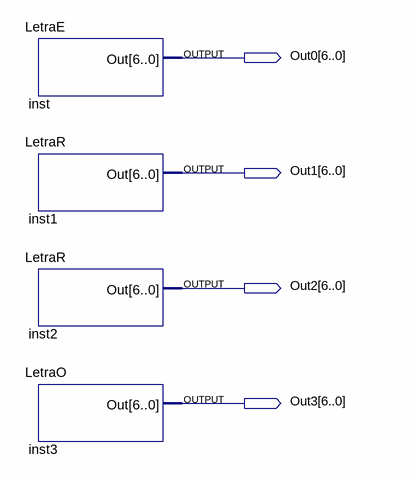
[diagram p0: schematic sheet]
// Quartus schematic displayerro.bdf as structural Verilog: 4 symbols, 4 pins
module displayerro (
  output [6:0] Out0,
  output [6:0] Out1,
  output [6:0] Out2,
  output [6:0] Out3
);

  LetraE inst (.Out(Out0));
  LetraR inst1 (.Out(Out1));
  LetraR inst2 (.Out(Out2));
  LetraO inst3 (.Out(Out3));
endmodule
